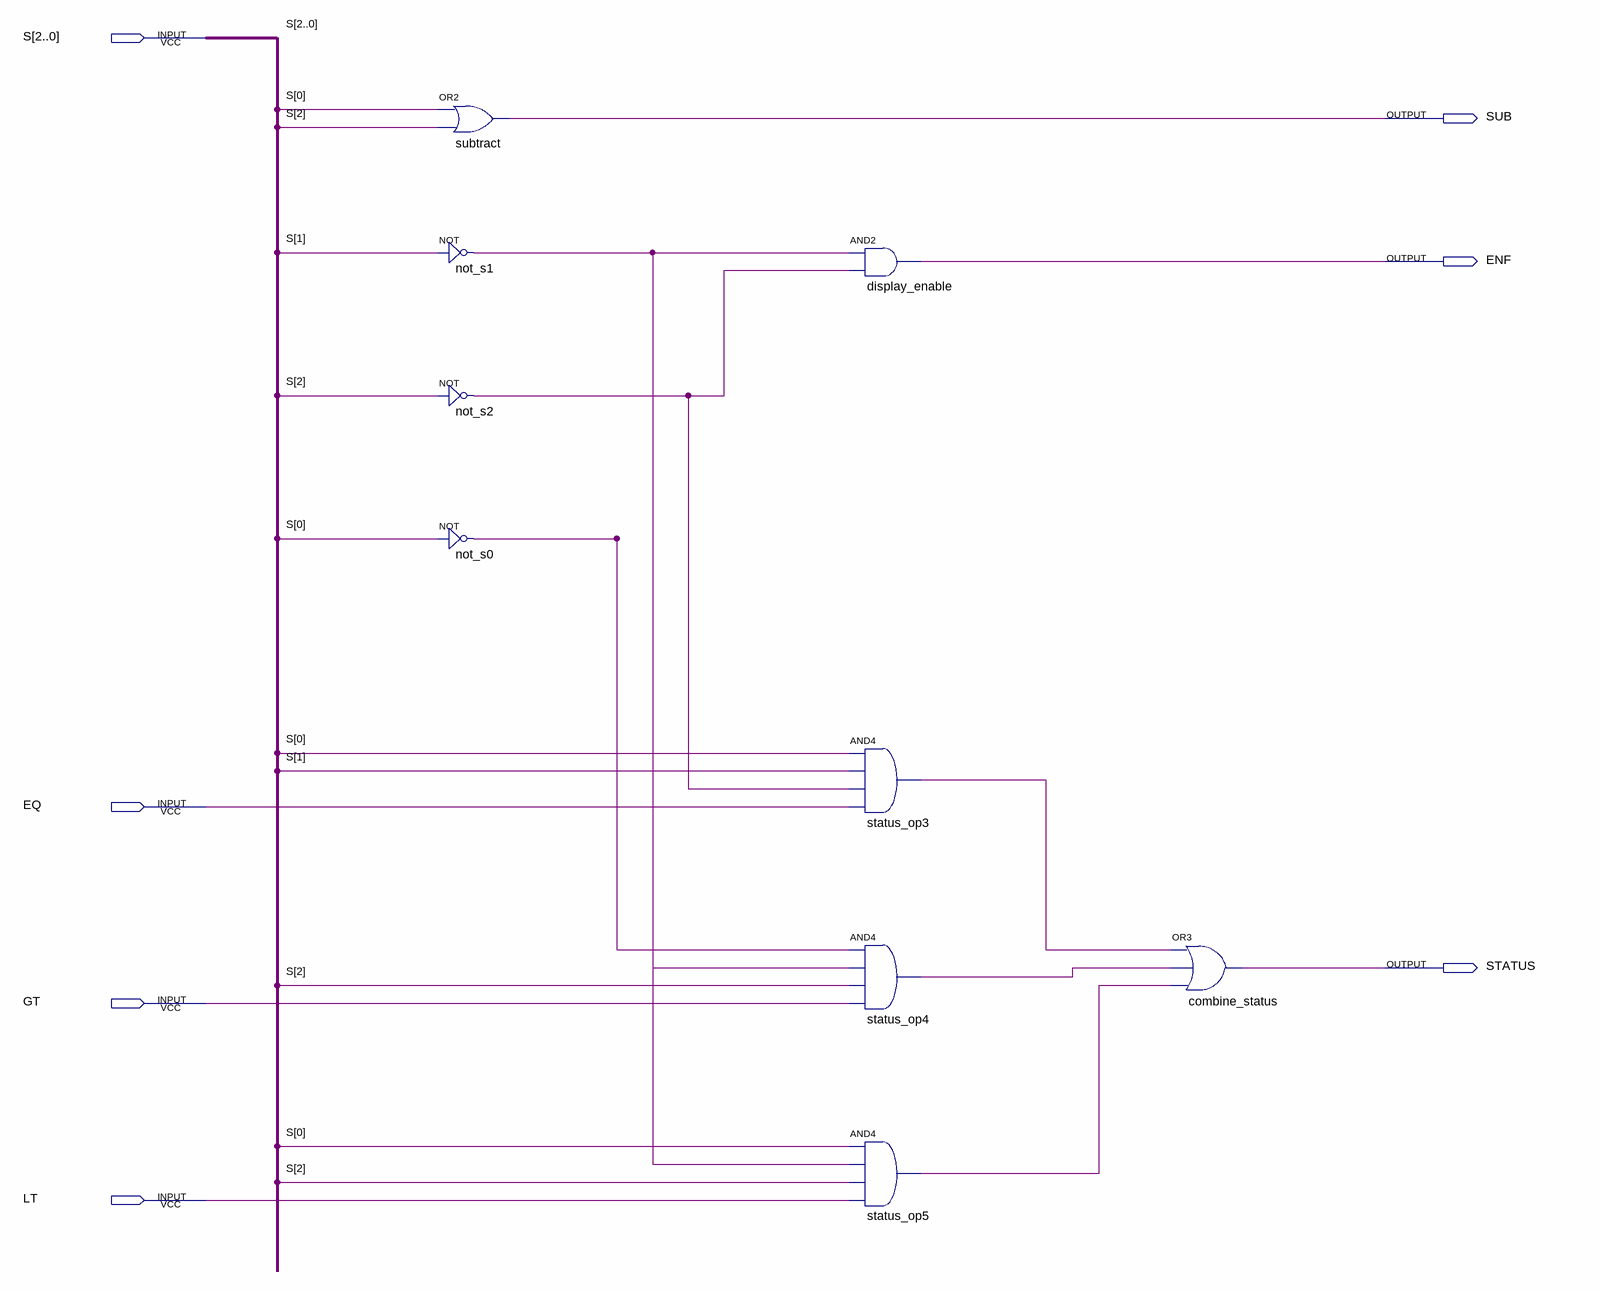
[diagram p0: schematic sheet]
// Quartus schematic CONTROLE.bdf as structural Verilog: 9 symbols, 7 pins
module CONTROLE (
  input  [2:0] S,
  input  EQ,
  input  GT,
  input  LT,
  output SUB,
  output ENF,
  output STATUS
);

  wire not_s0_out, not_s1_out, not_s2_out, status_op3_out, status_op4_out, status_op5_out;

  or subtract (SUB, S[0], S[2]);
  not not_s1 (not_s1_out, S[1]);
  not not_s2 (not_s2_out, S[2]);
  not not_s0 (not_s0_out, S[0]);
  and display_enable (ENF, not_s1_out, not_s2_out);
  and status_op3 (status_op3_out, S[0], S[1], not_s2_out, EQ);
  and status_op4 (status_op4_out, not_s0_out, not_s1_out, S[2], GT);
  and status_op5 (status_op5_out, S[0], not_s1_out, S[2], LT);
  or combine_status (STATUS, status_op3_out, status_op4_out, status_op5_out);
endmodule
